# EAGLE schematic atum (EAGLE 6.5.0)
AUTHOR: Brad Campbell; REV: A; TITLE: Atum

## Sheet 1 of 2
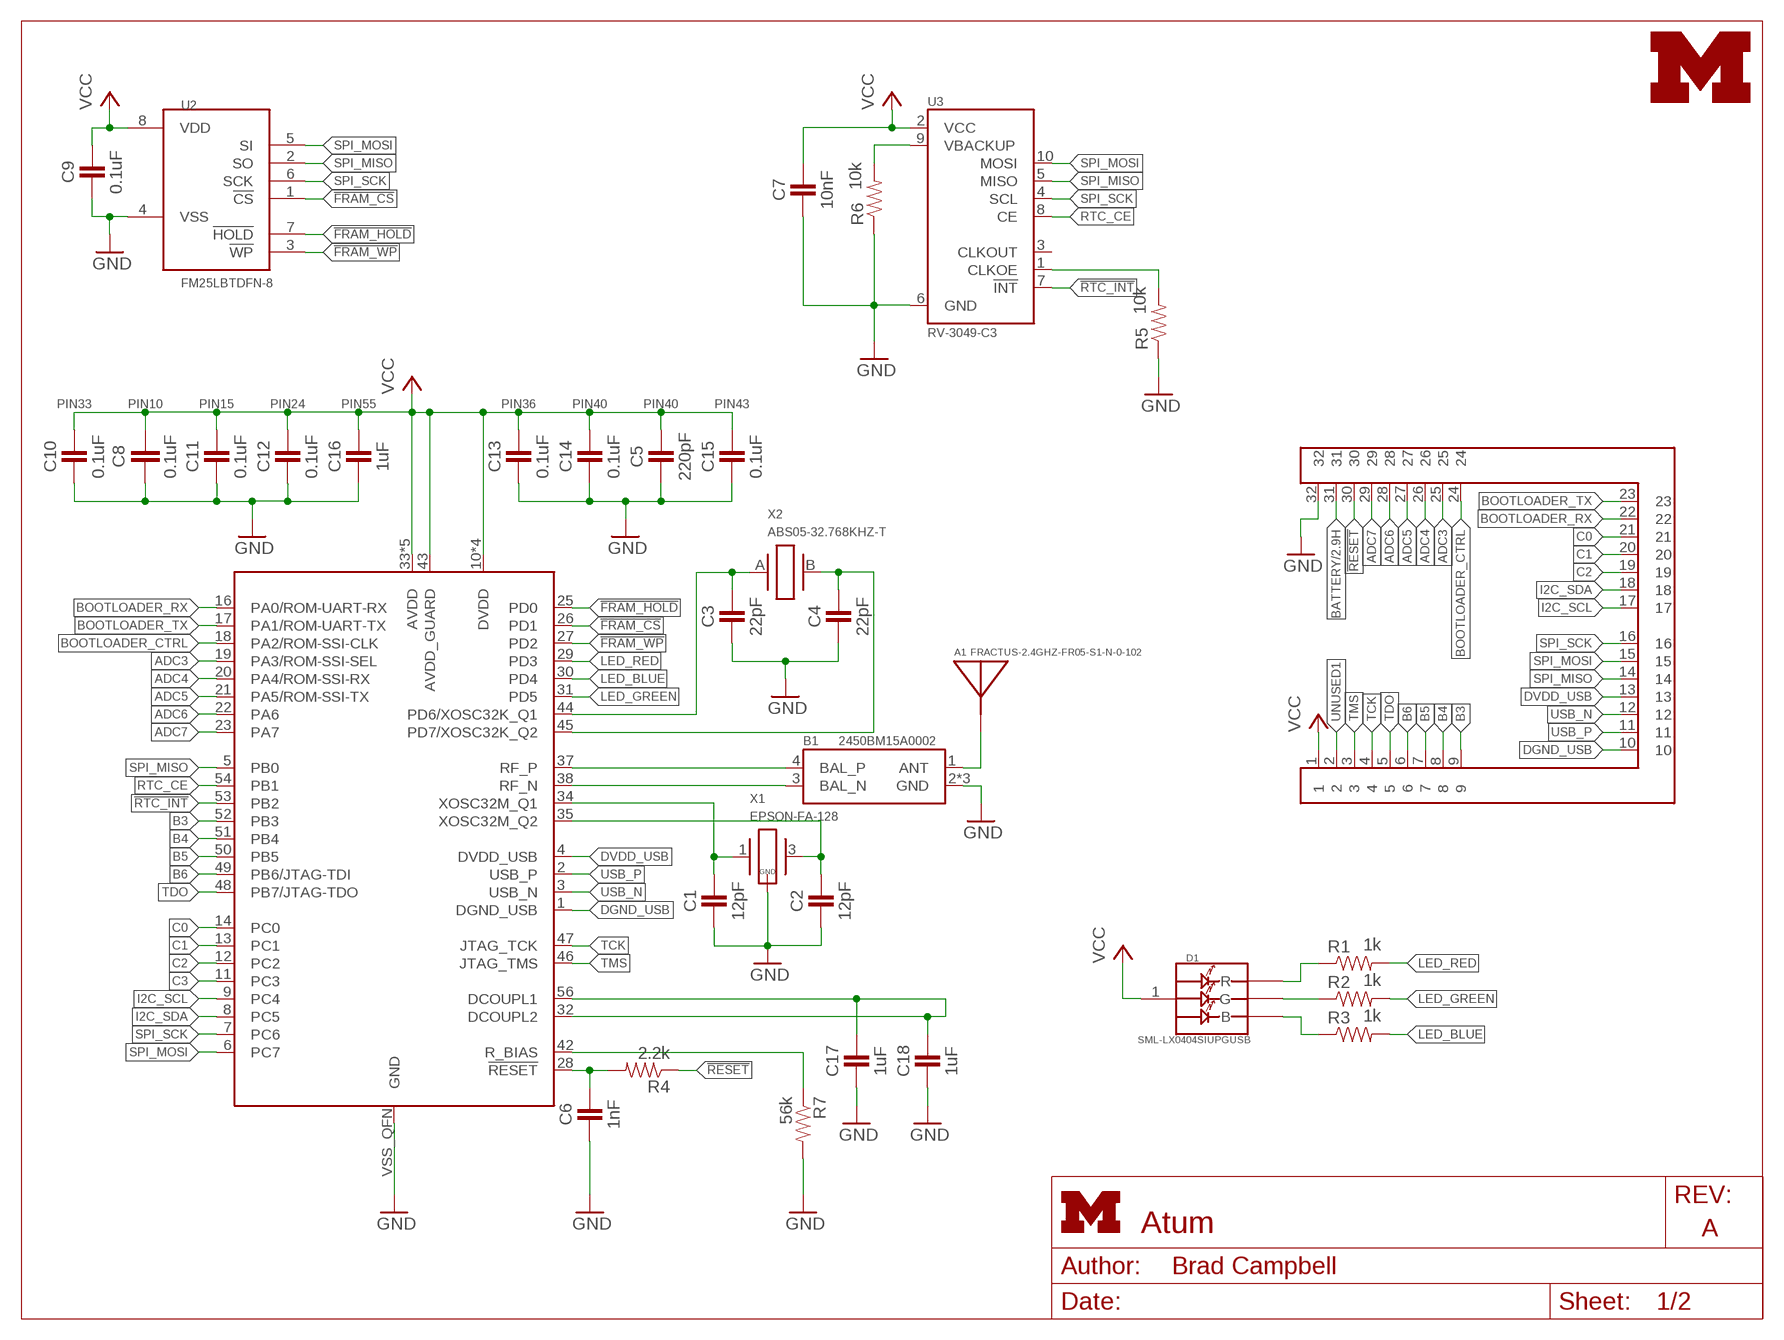
[diagram p0: schematic, sheet 1]
FRAME1 (LETTER_L): HEIGHT: 8.5in; WIDTH: 11in

### Parts
A1  FRACTUS-2.4GHZ-FR05-S1-N-0-102  [FRACTUS-ANTENNA-FR05-S1-N-0-102]
B1  2450BM15A0002  [2450BM]
C1  12pF  CAPACITOR  [0402_CAP]
C2  12pF  CAPACITOR  [0402_CAP]
C3  22pF  CAPACITOR  [0402_CAP]
C4  22pF  CAPACITOR  [0402_CAP]
C5  220pF  CAPACITOR  [0402_CAP]
C6  1nF  CAPACITOR  [0402_CAP]
C7  10nF  CAPACITOR  [0402_CAP]
C8  0.1uF  C-EUC0201  [C0201]
C9  0.1uF  CAPACITOR  [0402_CAP]
C10  0.1uF  CAPACITOR  [0402_CAP]
C11  0.1uF  CAPACITOR  [0402_CAP]
C12  0.1uF  CAPACITOR  [0402_CAP]
C13  0.1uF  CAPACITOR  [0402_CAP]
C14  0.1uF  CAPACITOR  [0402_CAP]
C15  0.1uF  CAPACITOR  [0402_CAP]
C16  1uF  CAPACITOR  [0402_CAP]
C17  1uF  CAPACITOR  [0402_CAP]
C18  1uF  CAPACITOR  [0402_CAP]
D1  SML-LX0404SIUPGUSB  [1MM_SQ_4PAD]
J1  EPIC2-HEADER2  [EPIC2-HEADER2]
LOGO1  UMICH_SOLID_TINY  [UMICH_SOLID_50MIL]
R1  1k  RESISTOR  [0402_RES]
R2  1k  RESISTOR  [0402_RES]
R3  1k  RESISTOR  [0402_RES]
R4  2.2k  RESISTOR  [0402_RES]
R5  10k  RESISTOR  [0402_RES]
R6  10k  RESISTOR  [0402_RES]
R7  56k  RESISTOR  [0402_RES]
U1  CC2538  [S-PVQFN-N56]
U2  FM25LBTDFN-8  [TDFN-8]
U3  RV-3049-C3  [MICRO-CRYSTAL-C3]
X1  EPSON-FA-128  [FA-128]
X2  ABS05-32.768KHZ-T  [ABS05]

### Nets
!FRAM_CS: U1.26(PD1) U2.1(!CS)
!FRAM_HOLD: U1.25(PD0) U2.7(!HOLD)
!FRAM_WP: U1.27(PD2) U2.3(!WP)
!RESET: J1.30 R4.1
!RTC_INT: U1.53(PB2) U3.7(!INT)
ADC3: J1.25 U1.19(PA3/ROM-SSI-SEL)
ADC4: J1.26 U1.20(PA4/ROM-SSI-RX)
ADC5: J1.27 U1.21(PA5/ROM-SSI-TX)
ADC6: J1.28 U1.22(PA6)
ADC7: J1.29 U1.23(PA7)
ANTENNA: A1.1(ANTENNA) B1.1(ANT)
B3: J1.9 U1.52(PB3)
B4: J1.8 U1.51(PB4)
B5: J1.7 U1.50(PB5)
B6: J1.6 U1.49(PB6/JTAG-TDI)
BATTERY: J1.31 ; also sheet 2
BOOTLOADER_CTRL: J1.24 U1.18(PA2/ROM-SSI-CLK)
BOOTLOADER_RX: J1.22 U1.16(PA0/ROM-UART-RX)
BOOTLOADER_TX: J1.23 U1.17(PA1/ROM-UART-TX)
C0: J1.21 U1.14(PC0)
C1: J1.20 U1.13(PC1)
C2: J1.19 U1.12(PC2)
C3: U1.11(PC3)
DGND_USB: J1.10 U1.1(DGND_USB)
DVDD_USB: J1.13 U1.4(DVDD_USB)
GND: B1.2(GND) B1.5(GND) B1.6(GND) C1.2 C2.2 C3.2 C4.2 C5.2 C6.2 C7.2 C8.2 C9.2 C10.2 C11.2 C12.2 C13.2 C14.2 C15.2 C16.2 C17.2 C18.2 J1.32 R5.1 R6.1 R7.2 U1.VSS_QFN(GND) U2.4(VSS) U3.6(GND) X1.2(GND) X1.4(GND) ; also sheet 2
I2C_SCL: J1.17 U1.9(PC4)
I2C_SDA: J1.18 U1.8(PC5)
LED_BLUE: R3.2 U1.30(PD4)
LED_GREEN: R2.2 U1.31(PD5)
LED_RED: R1.2 U1.29(PD3)
N$1: C6.1 R4.2 U1.28(!RESET)
N$6: C3.1 U1.44(PD6/XOSC32K_Q1) X2.A
N$7: D1.2(R) R1.1
N$8: R7.1 U1.42(R_BIAS)
N$9: C1.1 U1.34(XOSC32M_Q1) X1.1
N$10: C2.1 U1.35(XOSC32M_Q2) X1.3
N$11: D1.4(G) R2.1
N$12: D1.3(B) R3.1
N$13: C4.1 U1.45(PD7/XOSC32K_Q2) X2.B
N$14: R6.2 U3.9(VBACKUP)
N$15: C17.1 C18.1 U1.32(DCOUPL2) U1.56(DCOUPL1)
N$16: R5.2 U3.1(CLKOE)
RF_N: B1.3(BAL_N) U1.38(RF_N)
RF_P: B1.4(BAL_P) U1.37(RF_P)
RTC_CE: U1.54(PB1) U3.8(CE)
SPI_MISO: J1.14 U1.5(PB0) U2.2(SO) U3.5(MISO)
SPI_MOSI: J1.15 U1.6(PC7) U2.5(SI) U3.10(MOSI)
SPI_SCK: J1.16 U1.7(PC6) U2.6(SCK) U3.4(SCL)
TCK: J1.4 U1.47(JTAG_TCK)
TDO: J1.5 U1.48(PB7/JTAG-TDO)
TMS: J1.3 U1.46(JTAG_TMS)
UNUSED1: J1.2
USB_N: J1.12 U1.3(USB_N)
USB_P: J1.11 U1.2(USB_P)
VCC: C5.1 C7.1 C8.1 C9.1 C10.1 C11.1 C12.1 C13.1 C14.1 C15.1 C16.1 D1.1(VDD) J1.1 U1.10(DVDD) U1.15(DVDD) U1.24(DVDD) U1.33(AVDD) U1.36(AVDD) U1.39(AVDD) U1.40(AVDD) U1.41(AVDD) U1.43(AVDD_GUARD) U1.55(DVDD) U2.8(VDD) U3.2(VCC) ; also sheet 2
Unconnected: U3.3(CLKOUT)

### Notes on the sheet
- PIN33 | PIN10 | PIN15 | PIN24 | PIN55 | PIN36 | PIN40 | PIN40 | PIN43

## Sheet 2 of 2
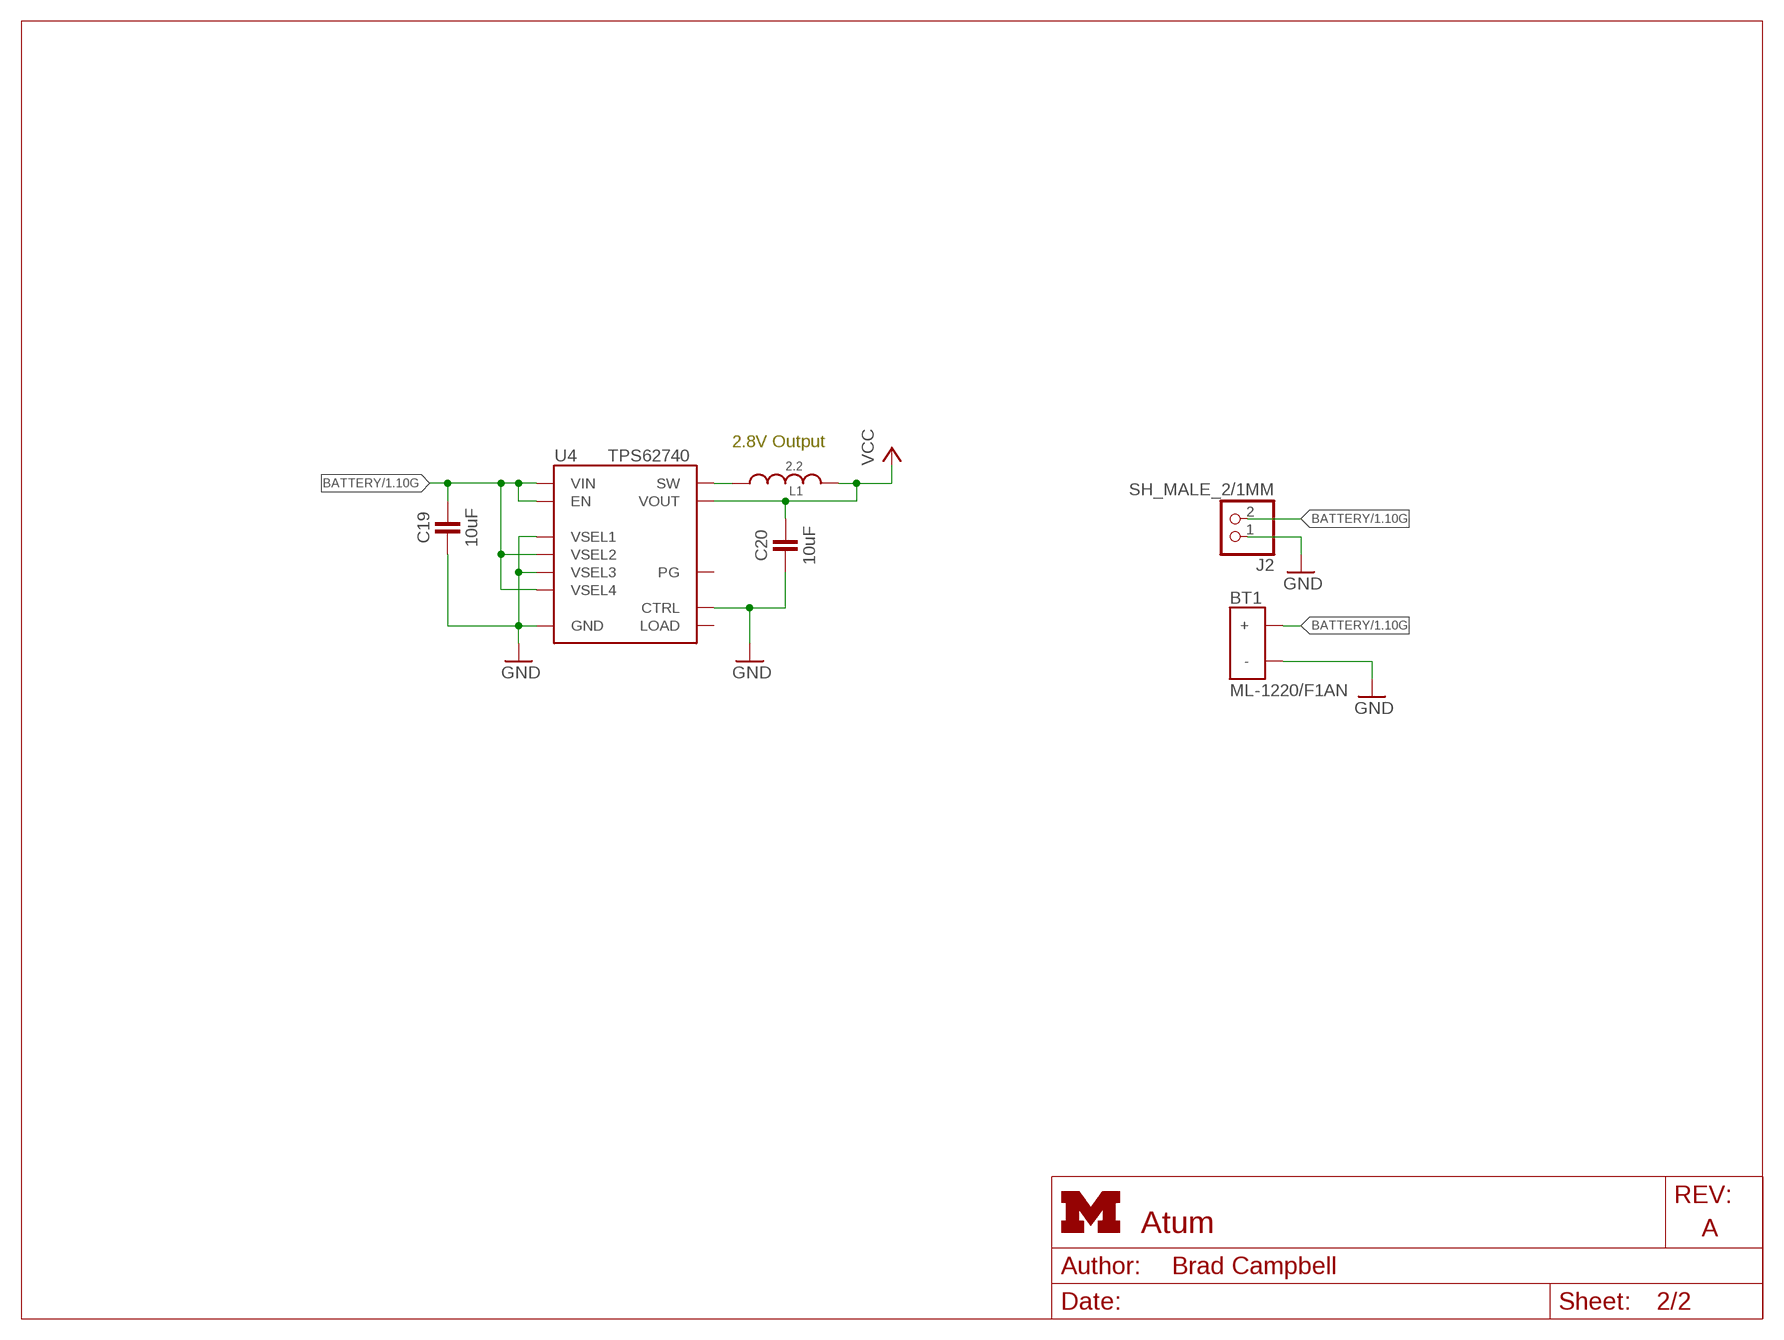
[diagram p1: schematic, sheet 2]
FRAME2 (LETTER_L): HEIGHT: 8.5in; WIDTH: 11in

### Parts
BT1  ML-1220/F1AN  [ML-1220/F1BN]
C19  10uF  CAPACITOR0603_CAP  [0603_CAP]
C20  10uF  CAPACITOR0603_CAP  [0603_CAP]
J2  SH_MALE_2/1MM  [SH-1X2/1MM]
L1  2.2  MIPSZ2012D  [MIPSZ201D]
U4  TPS62740  [R-PWSON-12]

### Nets
BATTERY: BT1.POS(+) C19.1 J2.2 U4.1(VIN) U4.8(VSEL4) U4.10(VSEL2) U4.12(EN) ; also sheet 1
GND: BT1.NEG(-) C19.2 C20.2 J2.1 U4.3(GND) U4.4(CTRL) U4.9(VSEL3) U4.11(VSEL1) U4.NC(GND) ; also sheet 1
N$5: L1.1 U4.2(SW)
VCC: C20.1 L1.2 U4.5(VOUT) ; also sheet 1
Unconnected: U4.6(LOAD) U4.7(PG)

### Notes on the sheet
- 2.8V Output

## Library data of the parts
A1 = chips:FRACTUS-2.4GHZ-FR05-S1-N-0-102: Fractus Compact Reach XtendTM chip antenna is engineered specifically for Bluetooth, WLAN 802.11 b/g/n and other wireless devices operating at the ISM 2.4 GHz band. Compact Reach Xtend combines small form factor size and high performance to improve the functionality of your wireless devices.; RICHARDSON_RFPD: FR05-S1-N-0102B
B1 = chips:2450BM15A0002: BALUN JTI MATCHED ZIGBEE; DIGIKEY: 712-1536-1-ND
BT1 = batteries:ML-1220/F1AN: BATTERY LITH 3V RECHARGE PC PINS; DIGIKEY: P663-nd; MOUSER: 658-ML-1220/F1BN
C1-C7 C9-C18 = passives:CAPACITOR: 0402 Capacitor
C8 = rcl:C-EU: CAPACITOR, European symbol
C19 C20 = passives:CAPACITOR: 0402 Capacitor; DIGIKEY: 490-7316-1-ND
D1 = leds:SML-LX0404SIUPGUSB: 1mm^2 RGB LED; DIGIKEY: 67-2125-1-ND
J1 = epic2:EPIC2-HEADER2
J2 = headers:SH_MALE_2/1MM: 1.0mm pitch/Disconnectable Crimp style connectors; DIGIKEY: 455-1788-2-ND
L1 = passives:MIPSZ2012D: FDK Multi-layer Power Inductor : MIPSZ2012D series (Very Small Type)
LOGO1 = logos:UMICH_SOLID
R1-R7 = passives:RESISTOR: Resistor Basic schematic elements and footprints for 0603, 1206, and PTH resistors.
U1 = chips:CC2538: A Powerful System-On-Chip for 2.4-GHz IEEE 802.15.4, 6LoWPAN and ZigBee Applications; DIGIKEY: 296-35797-1-ND; MOUSER: 595-CC2538SF53RTQT; NEWARK: 87W7713
U2 = chips:FM25LB: IC FRAM 4KBIT 10MHZ 8SOIC; DIGIKEY: FM25L04B-DGRA-ND; MOUSER: 877-FM25L04B-DG
U3 = chips:RV-3049-C3: The RV-3049-C3 is an ultra miniature Real-Time-Clock Module with embedded Crystal. This RTC has an SPI Bus (4-wire Serial- Interface) and offers temperature compensated time.
U4 = chips:TPS62740: 360nA Step Down Converter for Low Power Applications; DIGIKEY: 296-37134-1-ND; MOUSER: 595-TPS62740DSST; NEWARK: 27X9745
X1 = crystals:EPSON-FA-128: MHz RANGE CRYSTAL UNIT ULTRA MINIATURE SIZE LOW PROFILE SMD http://www.digikey.com/product-search/en?FV=ffec63d1
X2 = crystals:ABS05-32.768KHZ: 32.768kHz Crystal; DIGIKEY: 535-11899-1-ND